# Altium schematic sheet TsinghuaDoor_bottom.SchDoc
size A3
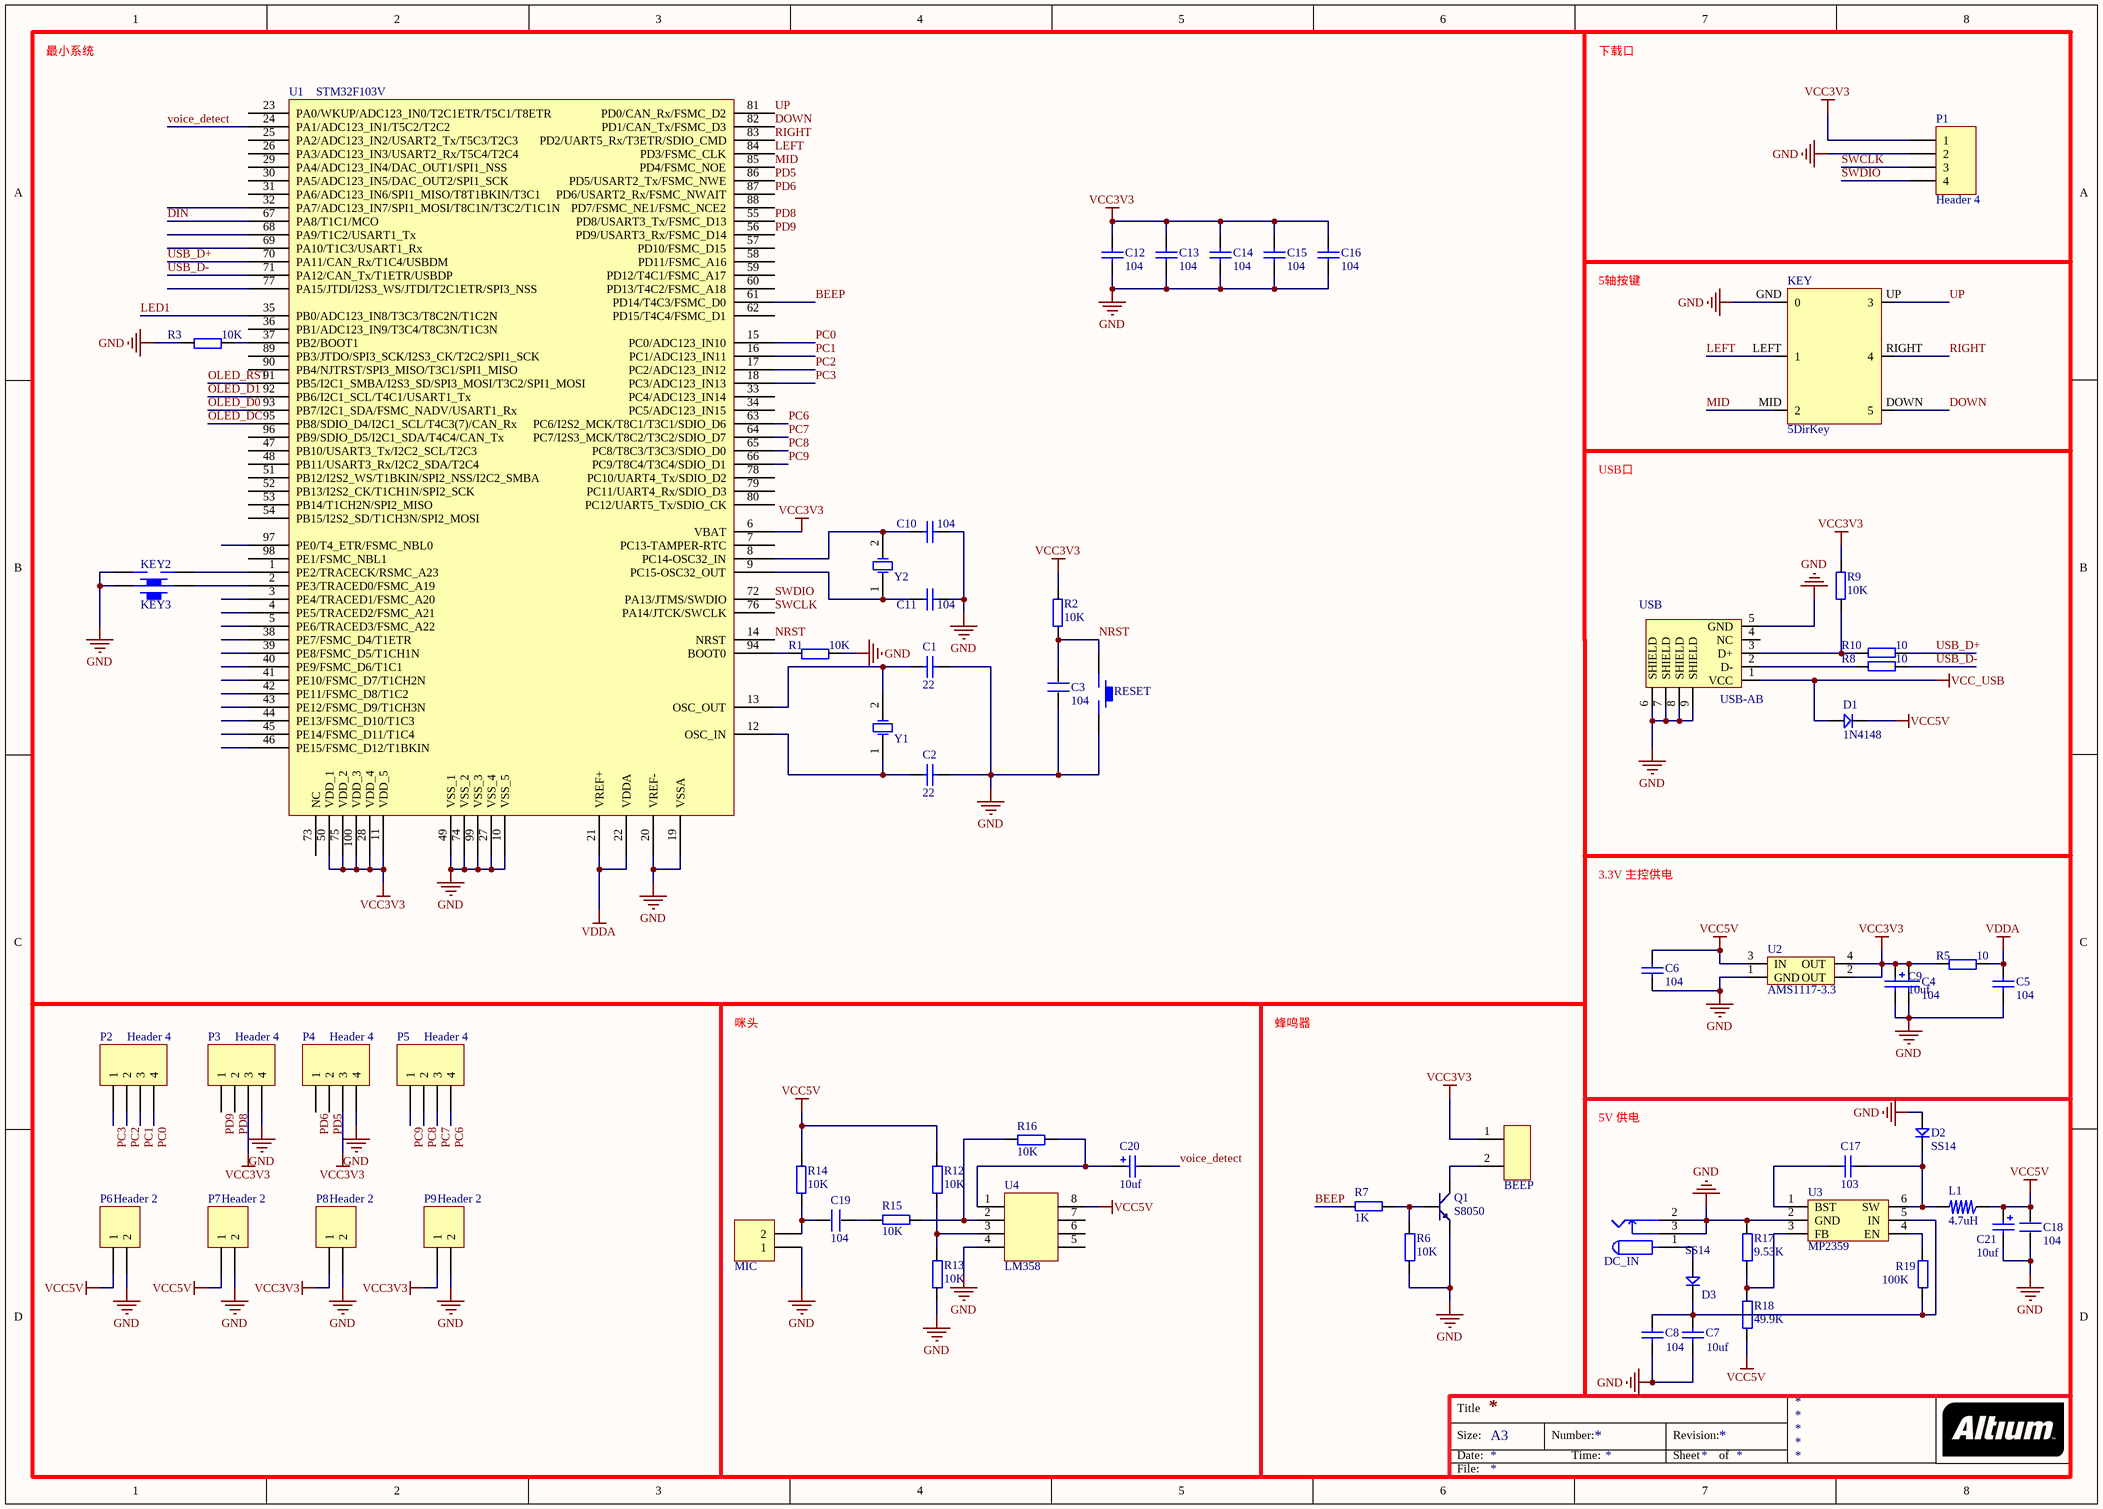
[diagram p0: TsinghuaDoor_bottom.SchDoc]

## Parts
BEEP  蜂鸣器  [蜂鸣器-7.6mm]  (value not drawn)
C1  value 22  [cap_0603 - duplicate]  (hidden comment: Cap)
C2  value 22  [cap_0603 - duplicate]  (hidden comment: Cap)
C3  104  [0603P]
C4  value 104  [cap_0603 - duplicate]  (hidden comment: Cap)
C5  value 104  [cap_0603 - duplicate]  (hidden comment: Cap)
C6  value 104  [cap_0603 - duplicate]  (hidden comment: Cap)
C7  value 10uf  [电容-0805]  (hidden comment: Cap)
C8  value 104  [电容-0805]  (hidden comment: Cap)
C9  value 10uf  [电容-6032]  (hidden comment: Cap Pol)
C10  value 104  [cap_0603 - duplicate]  (hidden comment: Cap)
C11  value 104  [cap_0603 - duplicate]  (hidden comment: Cap)
C12  value 104  [cap_0603 - duplicate]  (hidden comment: Cap)
C13  value 104  [cap_0603 - duplicate]  (hidden comment: Cap)
C14  value 104  [cap_0603 - duplicate]  (hidden comment: Cap)
C15  value 104  [cap_0603 - duplicate]  (hidden comment: Cap)
C16  value 104  [cap_0603 - duplicate]  (hidden comment: Cap)
C17  value 103  [电容-0805]  (hidden comment: Cap)
C18  104  [0603P]
C19  104  [1206]
C20  value 10uf  [电容-3528]  (hidden comment: Cap Pol)
C21  value 10uf  [电容-6032]  (hidden comment: Cap Pol)
D1  1N4148  [DIODE_3*5.3]
D2  SS14  [DIODE_3*5.3]
D3  SS14  [DIODE_3*5.3]
DC_IN  POWER  [DC10B]  (value not drawn)
KEY  5DirKey  [5DirKey]
KEY2  KEY_M  [KEY_M]  (value not drawn)
KEY3  KEY_M  [KEY_M]  (value not drawn)
L1  4.7uH  [L_SOP74]
MIC  VREF_SEL  [HDR1X2]  (value not drawn)
P1  Header 4  [HDR1X4]
P2  Header 4  [Header-1*4-2.54mm]
P3  Header 4  [Header-1*4-2.54mm]
P4  Header 4  [Header-1*4-2.54mm]
P5  Header 4  [Header-1*4-2.54mm]
P6  Header 2  [Header-1*2-2.54mm]
P7  Header 2  [Header-1*2-2.54mm]
P8  Header 2  [Header-1*2-2.54mm]
P9  Header 2  [Header-1*2-2.54mm]
Q1  S8050  [SOT-23R]
R1  10K  [0603P]
R2  10K  [0603P]
R3  10K  [0603P]
R5  10  [0603P]
R6  10K  [0603P]
R7  1K  [0603P]
R8  10  [0603P]
R9  10K  [0603P]
R10  10  [0603P]
R12  10K  [0603P]
R13  10K  [0603P]
R14  10K  [0603P]
R15  10K  [0603P]
R16  10K  [0603P]
R17  9.53K  [0603P]
R18  49.9K  [0603P]
R19  100K  [0603P]
RESET  KEY_M  [KEY_M]  (value not drawn)
U1  STM32F103V  [LQFP-100_M]
U2  AMS1117-3.3  [AMS1117]
U3  MP2359  [SOT-23-6]
U4  LM358  [SOP-8-4mm]
USB  USB-AB  [USB_AB - 5S - B]
Y1  晶振  [晶振-DIP2-5.08]  (value not drawn)
Y2  晶振  [圆柱晶振]  (value not drawn)

## Nets
GND: C1.1 C2.1 C3.1 C4.1 C5.1 C6.1 C7.1 C8.1 C9.2 C10.2 C11.2 C12.1 C13.1 C14.1 C15.1 C16.1 C18.1 C21.2 D2.1 DC_IN.2 DC_IN.3 KEY.GND(0) KEY2.2 KEY3.2 MIC.1 P1.2 P3.4 P4.4 P6.2 P7.2 P8.2 P9.2 Q1.1(E) R1.2 R3.1 R6.1 R13.1 R17.2 RESET.2 U1.10(VSS_5) U1.19(VSSA) U1.20(VREF-) U1.27(VSS_4) U1.49(VSS_1) U1.74(VSS_2) U1.99(VSS_3) U2.1(GND) U3.2(GND) U4.4 USB.5(GND) USB.6(SHIELD) USB.7(SHIELD) USB.8(SHIELD) USB.9(SHIELD)
VCC3V3: BEEP.1 C4.2 C9.1 C12.2 C13.2 C14.2 C15.2 C16.2 P1.1 P3.3 P4.3 P8.1 P9.1 R2.1 R5.1 R9.1 U1.6(VBAT) U1.11(VDD_5) U1.28(VDD_4) U1.50(VDD_1) U1.75(VDD_2) U1.100(VDD_3) U2.2(OUT) U2.4(OUT)
VCC5V: C6.2 C18.2 C21.1 D1.2 L1.1 P6.1 P7.1 R12.2 R14.1 R18.1 U2.3(IN) U4.8
VCC_USB: D1.1 USB.1(VCC)
VDDA: C5.2 R5.2 U1.21(VREF+) U1.22(VDDA)
BEEP: R7.2 U1.61(PD14/T4C3/FSMC_D0)
DIN: U1.67(PA8/T1C1/MCO)
DOWN: KEY.DOWN(5) U1.82(PD1/CAN_Tx/FSMC_D3)
LED1: U1.35(PB0/ADC123_IN8/T3C3/T8C2N/T1C2N)
LEFT: KEY.LEFT(1) U1.84(PD3/FSMC_CLK)
MID: KEY.MID(2) U1.85(PD4/FSMC_NOE)
NRST: C3.2 R2.2 RESET.1 U1.14(NRST)
OLED_D0: U1.93(PB7/I2C1_SDA/FSMC_NADV/USART1_Rx)
OLED_D1: U1.92(PB6/I2C1_SCL/T4C1/USART1_Tx)
OLED_DC: U1.95(PB8/SDIO_D4/I2C1_SCL/T4C3(7)/CAN_Rx)
OLED_RST: U1.91(PB5/I2C1_SMBA/I2S3_SD/SPI3_MOSI/T3C2/SPI1_MOSI)
PC0: P2.4 U1.15(PC0/ADC123_IN10)
PC1: P2.3 U1.16(PC1/ADC123_IN11)
PC2: P2.2 U1.17(PC2/ADC123_IN12)
PC3: P2.1 U1.18(PC3/ADC123_IN13)
PC6: P5.4 U1.63(PC6/I2S2_MCK/T8C1/T3C1/SDIO_D6)
PC7: P5.3 U1.64(PC7/I2S3_MCK/T8C2/T3C2/SDIO_D7)
PC8: P5.2 U1.65(PC8/T8C3/T3C3/SDIO_D0)
PC9: P5.1 U1.66(PC9/T8C4/T3C4/SDIO_D1)
PD5: P4.2 U1.86(PD5/USART2_Tx/FSMC_NWE)
PD6: P4.1 U1.87(PD6/USART2_Rx/FSMC_NWAIT)
PD8: P3.2 U1.55(PD8/USART3_Tx/FSMC_D13)
PD9: P3.1 U1.56(PD9/USART3_Rx/FSMC_D14)
RIGHT: KEY.RIGHT(4) U1.83(PD2/UART5_Rx/T3ETR/SDIO_CMD)
SWCLK: P1.3 U1.76(PA14/JTCK/SWCLK)
SWDIO: P1.4 U1.72(PA13/JTMS/SWDIO)
UP: KEY.UP(3) U1.81(PD0/CAN_Rx/FSMC_D2)
USB_D+: R10.1 U1.70(PA11/CAN_Rx/T1C4/USBDM)
USB_D-: R8.1 U1.71(PA12/CAN_Tx/T1ETR/USBDP)
voice_detect: C20.2 U1.24(PA1/ADC123_IN1/T5C2/T2C2)
NetBEEP_2: BEEP.2 Q1.3(C)
NetC1_2: C1.2 U1.13(OSC_OUT) Y1.2(OSC2)
NetC2_2: C2.2 U1.12(OSC_IN) Y1.1(OSC1)
NetC7_2: C7.2 C8.2 D3.2 R19.1 U3.5(IN)
NetC10_1: C10.1 U1.8(PC14-OSC32_IN) Y2.2(OSC2)
NetC11_1: C11.1 U1.9(PC15-OSC32_OUT) Y2.1(OSC1)
NetC17_1: C17.1 U3.1(BST)
NetC17_2: C17.2 D2.2 L1.2 U3.6(SW)
NetC19_1: C19.1 MIC.2 R14.2
NetC19_2: C19.2 R15.2
NetC20_1: C20.1 R16.2 U4.1
NetD3_1: D3.1 DC_IN.1
NetKEY2_1: KEY2.1 U1.1(PE2/TRACECK/RSMC_A23)
NetKEY3_1: KEY3.1 U1.2(PE3/TRACED0/FSMC_A19)
NetQ1_2: Q1.2(B) R6.2 R7.1
NetR1_1: R1.1 U1.94(BOOT0)
NetR3_2: R3.2 U1.37(PB2/BOOT1)
NetR8_2: R8.2 USB.2(D-)
NetR9_2: R9.2 R10.2 USB.3(D+)
NetR12_1: R12.1 R13.2 U4.3
NetR15_1: R15.1 R16.1 U4.2
NetR17_1: R17.1 R18.2 U3.3(FB)
NetR19_2: R19.2 U3.4(EN)

Not connected (* = marked no-connect by the designer): U1 3(PE4/TRACED1/FSMC_A20) 4(PE5/TRACED2/FSMC_A21) 5(PE6/TRACED3/FSMC_A22) 7(PC13-TAMPER-RTC) 23(PA0/WKUP/ADC123_IN0/T2C1ETR/T5C1/T8ETR) 25(PA2/ADC123_IN2/USART2_Tx/T5C3/T2C3) 26(PA3/ADC123_IN3/USART2_Rx/T5C4/T2C4) 29(PA4/ADC123_IN4/DAC_OUT1/SPI1_NSS) 30(PA5/ADC123_IN5/DAC_OUT2/SPI1_SCK) 31(PA6/ADC123_IN6/SPI1_MISO/T8T1BKIN/T3C1) 32(PA7/ADC123_IN7/SPI1_MOSI/T8C1N/T3C2/T1C1N) 33(PC4/ADC123_IN14) 34(PC5/ADC123_IN15) 36(PB1/ADC123_IN9/T3C4/T8C3N/T1C3N) 38(PE7/FSMC_D4/T1ETR) 39(PE8/FSMC_D5/T1CH1N) 40(PE9/FSMC_D6/T1C1) 41(PE10/FSMC_D7/T1CH2N) 42(PE11/FSMC_D8/T1C2) 43(PE12/FSMC_D9/T1CH3N) 44(PE13/FSMC_D10/T1C3) 45(PE14/FSMC_D11/T1C4) 46(PE15/FSMC_D12/T1BKIN) 47(PB10/USART3_Tx/I2C2_SCL/T2C3) 48(PB11/USART3_Rx/I2C2_SDA/T2C4) 51(PB12/I2S2_WS/T1BKIN/SPI2_NSS/I2C2_SMBA) 52(PB13/I2S2_CK/T1CH1N/SPI2_SCK) 53(PB14/T1CH2N/SPI2_MISO) 54(PB15/I2S2_SD/T1CH3N/SPI2_MOSI) 57(PD10/FSMC_D15) 58(PD11/FSMC_A16) 59(PD12/T4C1/FSMC_A17) 60(PD13/T4C2/FSMC_A18) 62(PD15/T4C4/FSMC_D1) 68(PA9/T1C2/USART1_Tx) 69(PA10/T1C3/USART1_Rx) 73(NC) 77(PA15/JTDI/I2S3_WS/JTDI/T2C1ETR/SPI3_NSS) 78(PC10/UART4_Tx/SDIO_D2) 79(PC11/UART4_Rx/SDIO_D3) 80(PC12/UART5_Tx/SDIO_CK) 88(PD7/FSMC_NE1/FSMC_NCE2) 89(PB3/JTDO/SPI3_SCK/I2S3_CK/T2C2/SPI1_SCK) 90(PB4/NJTRST/SPI3_MISO/T3C1/SPI1_MISO) 96(PB9/SDIO_D5/I2C1_SDA/T4C4/CAN_Tx) 97(PE0/T4_ETR/FSMC_NBL0) 98(PE1/FSMC_NBL1); U4 5 6 7; USB 4(NC)

## Notes on the sheet
- 最小系统
- 下载口
- 5轴按键
- USB口
- 3.3V 主控供电
- 咪头
- 蜂鸣器
- 5V 供电
- Title
- Size:
- Date:
- A3
- Number:
- Time:
- Revision:
- Sheet
- of
- File:

## Library data of the parts
C1 C2 C4-C8 C10-C17 = Cap: Capacitor; Published: 8-Jun-2000; LatestRevisionDate: 17-Jul-2002; LatestRevisionNote: Re-released for DXP Platform.; PackageReference: RAD-0.3; Publisher: Altium Limited; PackageDescription: Radial Cap, Thru-Hole; 2 Leads; 0.3 in Pin Spacing
C3 C18 C19 = C
C9 C20 C21 = Cap Pol: Polarized Capacitor (Radial); Published: 8-Jun-2000; LatestRevisionDate: 17-Jul-2002; LatestRevisionNote: Re-released for DXP Platform.; PackageReference: RB7.6-15; Publisher: Altium Limited; PackageDescription: Polarized Capacitor (Radial); 2 Leads
D1-D3 = D
DC_IN = POW
L1 = L_SOP
MIC P6-P9 = Header 2: Header, 2-Pin; LatestRevisionDate: 17-Jul-2002; LatestRevisionNote: Re-released for DXP Platform.; Publisher: Altium Limited
P1-P5 = Header 4: Header, 4-Pin; LatestRevisionDate: 17-Jul-2002; LatestRevisionNote: Re-released for DXP Platform.; Publisher: Altium Limited
Q1 = NPN: 8050/BCW846/BCW847
R1-R3 R5-R10 R12-R19 = R
U1 = STM32F103V: STM32单片机100引脚
U2 = AMS1117
U3 = MP2359: DC DC Step Down IC
U4 = IC-8
USB = USB-AB: MicroUSB
Y1 Y2 = 晶振: Crystal Oscillator; Published: 8-Jun-2000; LatestRevisionDate: 17-Jul-2002; LatestRevisionNote: Re-released for DXP Platform.; PackageReference: R38; Publisher: Altium Limited; PackageDescription: Crystal, Thru-Hole; 2 Leads; Body 3.1 x 8.2 mm (Dia.xH)